# EAGLE design Qwiic EEPROM (EAGLE 9.0.1)
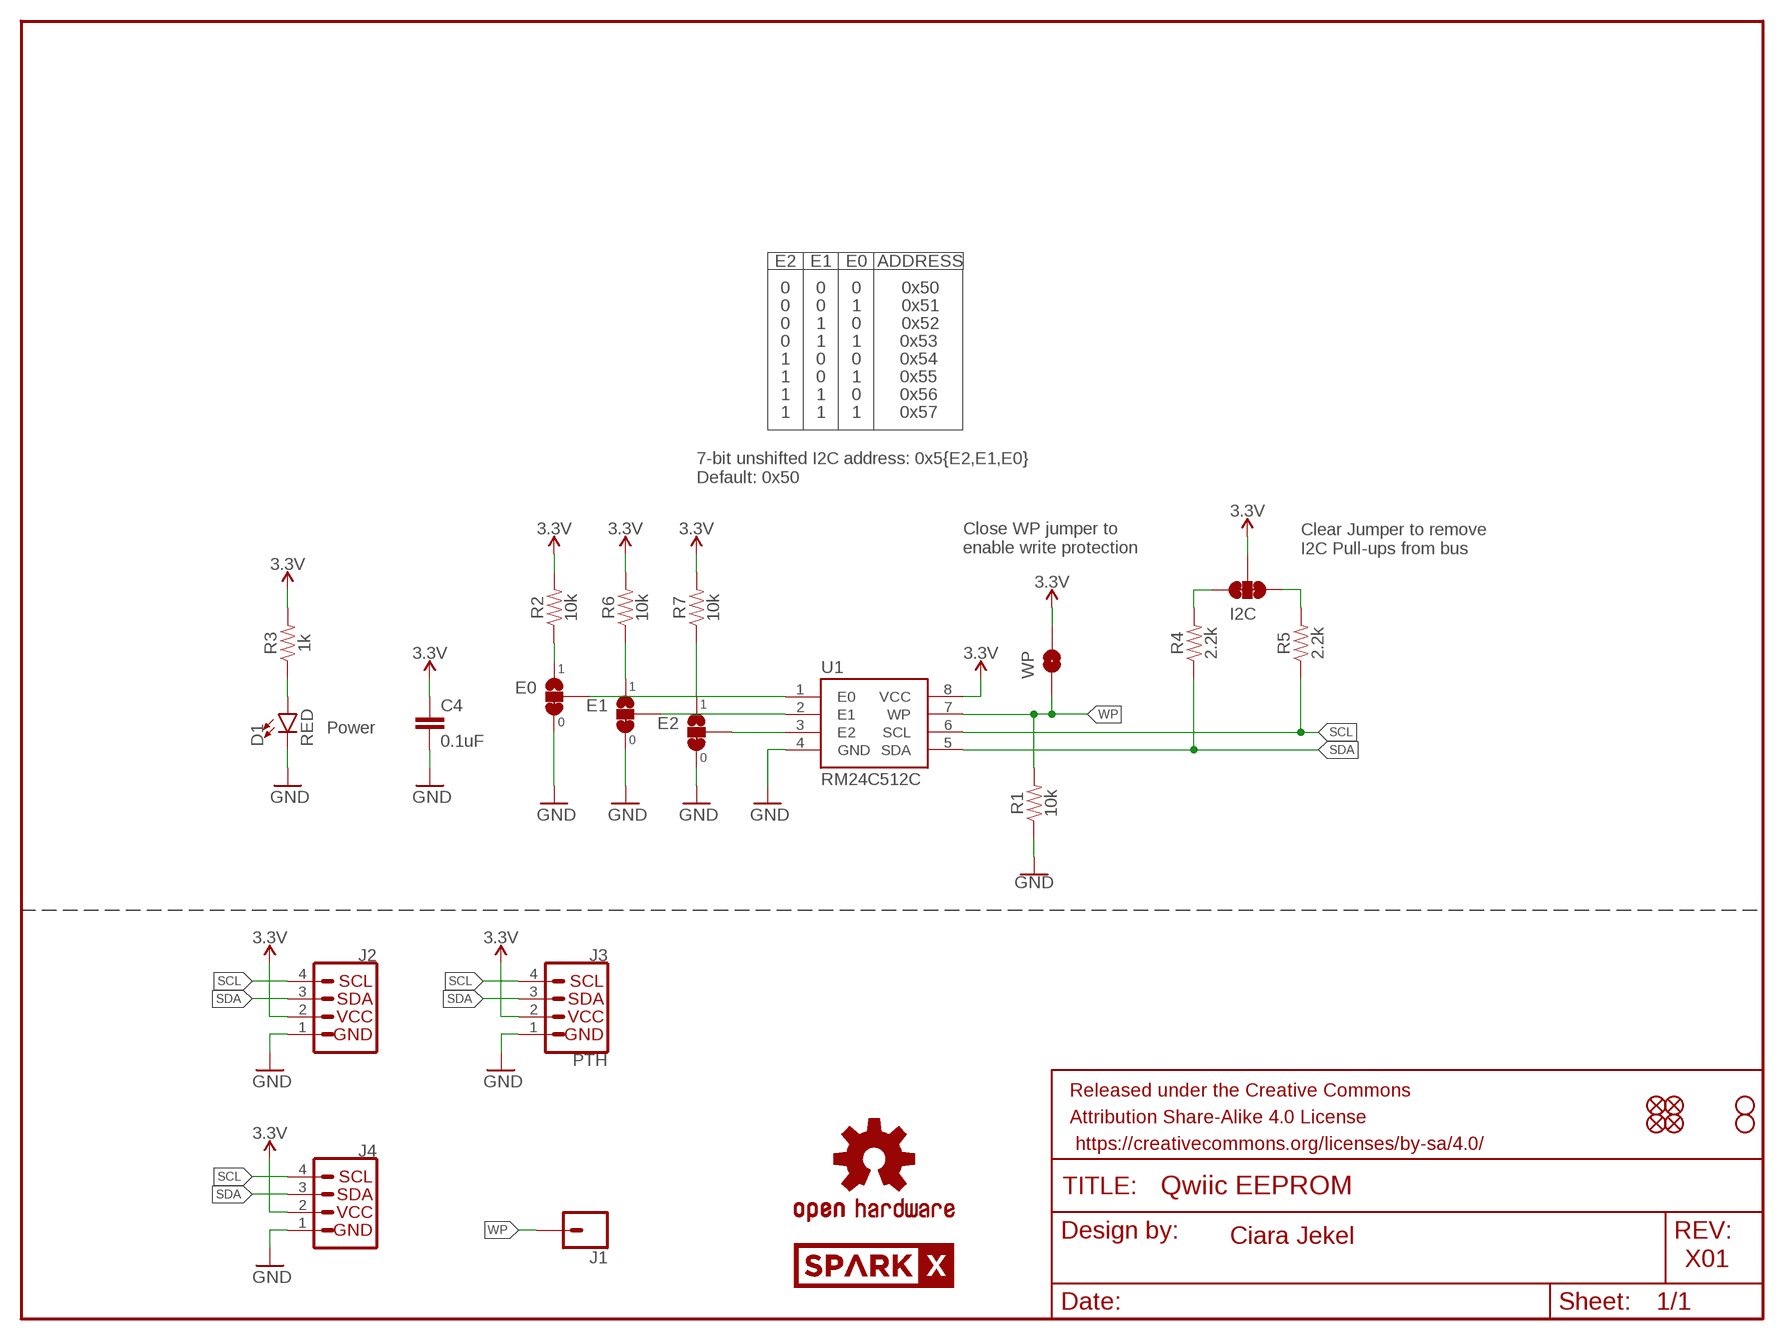
[diagram p0: schematic, sheet 1]

## Parts
C4  0.1uF  0.1UF-0603-25V-(+80/-20%)  [0603]
D1  RED  LED-RED0603  [LED-0603]
E0  JUMPER-SMT_3_1-NC_TRACE_SILK  [SMT-JUMPER_3_1-NC_TRACE_SILK]
E1  JUMPER-SMT_3_1-NC_TRACE_SILK  [SMT-JUMPER_3_1-NC_TRACE_SILK]
E2  JUMPER-SMT_3_1-NC_TRACE_SILK  [SMT-JUMPER_3_1-NC_TRACE_SILK]
FRAME1  FRAME-LETTER  [CREATIVE_COMMONS]
I2C  JUMPER-SMT_3_2-NC_TRACE_SILK  [SMT-JUMPER_3_2-NC_TRACE_SILK]
J1  CONN_01PTH_NO_SILK_YES_STOP  [1X01_NO_SILK]
J2  QWIIC_CONNECTORJS-1MM  [1X04_1MM_RA]
J3  PTH  I2C_STANDARD_NO_SILK  [1X04_NO_SILK]
J4  QWIIC_CONNECTORJS-1MM  [1X04_1MM_RA]
JP1  FIDUCIALUFIDUCIAL  [MICRO-FIDUCIAL]
JP2  FIDUCIALUFIDUCIAL  [MICRO-FIDUCIAL]
JP3  STAND-OFF  [STAND-OFF]
JP4  STAND-OFF  [STAND-OFF]
JP5  FIDUCIALUFIDUCIAL  [MICRO-FIDUCIAL]
JP6  FIDUCIALUFIDUCIAL  [MICRO-FIDUCIAL]
LOGO1  OSHW-LOGOMINI  [OSHW-LOGO-MINI]
R1  10k  10KOHM-0603-1/10W-1%  [0603]
R2  10k  10KOHM-0603-1/10W-1%  [0603]
R3  1k  1KOHM-0603-1/10W-1%  [0603]
R4  2.2k  2.2KOHM-0603-1/10W-1%  [0603]
R5  2.2k  2.2KOHM-0603-1/10W-1%  [0603]
R6  10k  10KOHM-0603-1/10W-1%  [0603]
R7  10k  10KOHM-0603-1/10W-1%  [0603]
U1  RM24C512C  [SO08]
U$1  SPARKX-LOGO4  [SPARKX-MEDIUM]
U$2  SPARKX-LOGO4  [SPARKX-MEDIUM]
WP  JUMPER-SMT_2_NO_SILK  [SMT-JUMPER_2_NO_SILK]

## Nets
3.3V: C4.1 I2C.2 J2.2 J3.2(VCC) J4.2 R2.2 R3.2 R6.2 R7.2 U1.8(VCC) WP.2
GND: C4.2 D1.C E0.3 E1.3 E2.3 J2.1 J3.1(GND) J4.1 R1.1 U1.4(GND)
N$1: I2C.1 R5.2
N$2: I2C.3 R4.2
N$3: D1.A R3.1
N$4: E2.2 U1.3(E2)
N$5: E1.2 U1.2(E1)
N$6: E0.2 U1.1(E0)
N$7: E0.1 R2.1
N$8: E2.1 R7.1
N$9: E1.1 R6.1
SCL: J2.4 J3.4(SCL) J4.4 R5.1 U1.6(SCL)
SDA: J2.3 J3.3(SDA) J4.3 R4.1 U1.5(SDA)
WP: J1.1 R1.2 U1.7(WP) WP.1

## Notes on the sheet
- E2 | E1 | E0 | ADDRESS
- 0 | 0 | 0 | 0x50
- 0 | 0 | 1 | 0x51
- 0 | 1 | 0 | 0x52
- 0 | 1 | 1 | 0x53
- 1 | 0 | 0 | 0x54
- 1 | 0 | 1 | 0x55
- 1 | 1 | 0 | 0x56
- 1 | 1 | 1 | 0x57
- 7-bit unshifted I2C address: 0x5{E2,E1,E0}
  Default: 0x50
- Clear Jumper to remove 
  I2C Pull-ups from bus
- Close WP jumper to 
  enable write protection
- 1
- 1
- 1
- 0
- Power
- 0
- 0
- Ciara Jekel
- X01

## Library data of the parts
C4 = SparkFun-Capacitors:0.1UF: 0.1µF ceramic capacitors A capacitor is a passive two-terminal electrical component used to store electrical energy temporarily in an electric field.; PROD_ID: CAP-00810
D1 = SparkFun-LED:LED-RED: Red SMD LED Used in manufacturing of most products at SparkFun Packages: 0603 - SMD 0603 package [Product Link] <http://docs.avagotech.com/docs/AV02-0551EN> 0603 SMART - SMD 0603 SMART package ( more efficient and expensive)[Product Link] <http://www.osram-os.com/Graphics/XPic2/00077099_0.pdf> 1206 - SMD1206 package [Product Link] <https://www.sparkfun.com/datasheets/DevTools/LilyPad/Q150OVS4.pdff> SparkFun Products: Pro Mini 328 -5V <https://www.sparkfun.com/products/821> RedBoard <https://www.sparkfun.com/products/12757> IOIO-OTG <https://www.sparkfun.com/products/13613>; PROD_ID: DIO-00819
E0 E1 E2 = SparkFun-Jumpers:JUMPER-SMT_3_1-NC_TRACE: Normally closed trace jumper (1 of 2 connections) This jumper has a trace between two pads so it's normally closed (NC). The other connection is normally open (NO). Use a razor knife to open the connection. For best results follow the IPC guidelines for cutting traces: Cutout at least 0.063 mm (0.005 in). Remove all loose material to clean up the cut area. Seal the cut with an approved epoxy. Reapply solder to reclose the connection, or to close the NO connection.
FRAME1 = SparkFun-Aesthetics:FRAME-LETTER: Schematic Frame - Letter Standard 8.5x11 US Letter frame
I2C = SparkFun-Jumpers:JUMPER-SMT_3_2-NC_TRACE: Normally closed trace jumper (2 of 2 connections) This jumper has a trace between all three pads so they are normally closed (NC). Use a razor knife to open the connection(s). For best results follow the IPC guidelines for cutting traces: Cutout at least 0.063 mm (0.005 in). Remove all loose material to clean up the cut area. Seal the cut with an approved epoxy. Reapply solder to reclose the connection(s).
J1 = SparkFun-Connectors:CONN_01: Single connection point. Often used as Generic Header-pin footprint for 0.1 inch spaced/style header connections On any of the 0.1 inch spaced packages, you can populate with these: Break Away Headers - Straight <https://www.sparkfun.com/products/116> (PRT-00116) Break Away Male Headers - Right Angle <https://www.sparkfun.com/products/553> (PRT-00553) Female Headers <https://www.sparkfun.com/products/115> (PRT-00115) Break Away Headers - Machine Pin <https://www.sparkfun.com/products/117> (PRT-00117) Break Away Female Headers - Swiss Machine Pin <https://www.sparkfun.com/products/743> (PRT-00743) This device is also useful as a general connection point to wire up your design to another part of your project. Our various solder wires solder well into these plated through hole pads. Hook-Up Wire - Assortment (Stranded, 22 AWG) <https://www.sparkfun.com/products/11375> (PRT-11375) Hook-Up Wire - Assortment (Solid Core, 22 AWG) <https://www.sparkfun.com/products/11367> (PRT-11367) View the entire wire category on our website here <https://www.sparkfun.com/categories/141> Special notes: SMTSO-256-ET is a "flush mount" nut for a 4-40 screw. We mostly use this on specialty testbeds; it is a nice way to connect hardware to your PCB at an adjustable hieght. Also note, the SNAP packages are for using a snappable style connector. We sell a baggie of snaps and they are also used on two LilyPad designs: Snap Assortment - 30 pack (male and female) <https://www.sparkfun.com/products/11347> (DEV-11347) LilyPad Arduino SimpleSnap <https://www.sparkfun.com/products/10941> (DEV-10941) LilyPad SimpleSnap Protoboard <https://www.sparkfun.com/products/10940> (DEV-10940)
J2 J4 = SparkFun-Connectors:QWIIC_CONNECTOR: SparkFun I2C Standard Qwiic Connector An SMD 1mm pitch JST connector makes it easy and quick (get it? Qwiic?) to connect I2C devices to each other. The Qwiic system <http://www.sparkfun.com/qwiic> enables fast and solderless connection between popular platforms and various sensors and actuators. We carry 200mm <https://www.sparkfun.com/products/14204>, 100mm <https://www.sparkfun.com/products/14205>, 50mm <https://www.sparkfun.com/products/14206>, and breadboard friendly <https://www.sparkfun.com/products/14207> Qwiic cables. We also offer 10 pcs strips <https://www.sparkfun.com/products/14323> the SMD connectors.; PROD_ID: CONN-13694
J3 = SparkX:I2C_STANDARD: SparkFun I2C Standard Pinout Header SparkFun has standardized on a pinout for all I2C based sensor breakouts. This pinout allows I2C boards to be plugged directly into the headers on Arduino Uno compatible boards, and to be daisy chained easily. Example SparkFun Products: SparkFun Atmospheric Sensor Breakout - BME280 <https://www.sparkfun.com/products/13676> SparkFun Altitude/Pressure Sensor Breakout - MPL3115A2 <https://www.sparkfun.com/products/11084> SparkFun TOF Range Finder Sensor - VL6180 <https://www.sparkfun.com/products/12785>
JP1 JP2 JP5 JP6 = SparkFun:FIDUCIAL: Fiducial Alignment Points Various fiducial points for machine vision alignment.
JP3 JP4 = SparkFun:STAND-OFF: Stand Off This is the mechanical footprint for a #4 phillips button head screw. Use the keepout ring to avoid running the screw head into surrounding components. SKU : PRT-00447
LOGO1 = SparkFun-Aesthetics:OSHW-LOGO: Open-Source Hardware (OSHW) Logo This logo indicates the piece of hardware it is found on incorporates a OSHW license and/or adheres to the definition of open source hardware found here: http://freedomdefined.org/OSHW
R1 R2 R6 R7 = SparkFun-Resistors:10KOHM: 10kΩ resistor A resistor is a passive two-terminal electrical component that implements electrical resistance as a circuit element. Resistors act to reduce current flow, and, at the same time, act to lower voltage levels within circuits. - Wikipedia; PROD_ID: RES-00824
R3 = SparkFun-Resistors:1KOHM: 1kΩ resistor A resistor is a passive two-terminal electrical component that implements electrical resistance as a circuit element. Resistors act to reduce current flow, and, at the same time, act to lower voltage levels within circuits. - Wikipedia; PROD_ID: RES-07856
R4 R5 = SparkFun-Resistors:2.2KOHM: 2.2kΩ resistor A resistor is a passive two-terminal electrical component that implements electrical resistance as a circuit element. Resistors act to reduce current flow, and, at the same time, act to lower voltage levels within circuits. - Wikipedia; PROD_ID: RES-08272
U1 = SparkFun-IC-Memory:RM24C512C
U$1 U$2 = SparkX:SPARKX-LOGO
WP = SparkFun-Jumpers:JUMPER-SMT_2_NO: Normally open jumper This jumper has two pads in close proximity to each other. Apply solder to close the connection. Round pads are easier to solder for beginners, but are a lot larger. SparkFun Product that uses the round pads: SparkFun EL Sequencer <https://www.sparkfun.com/products/12781>

## Net classes
1 power: width 0.203 mm

## Board
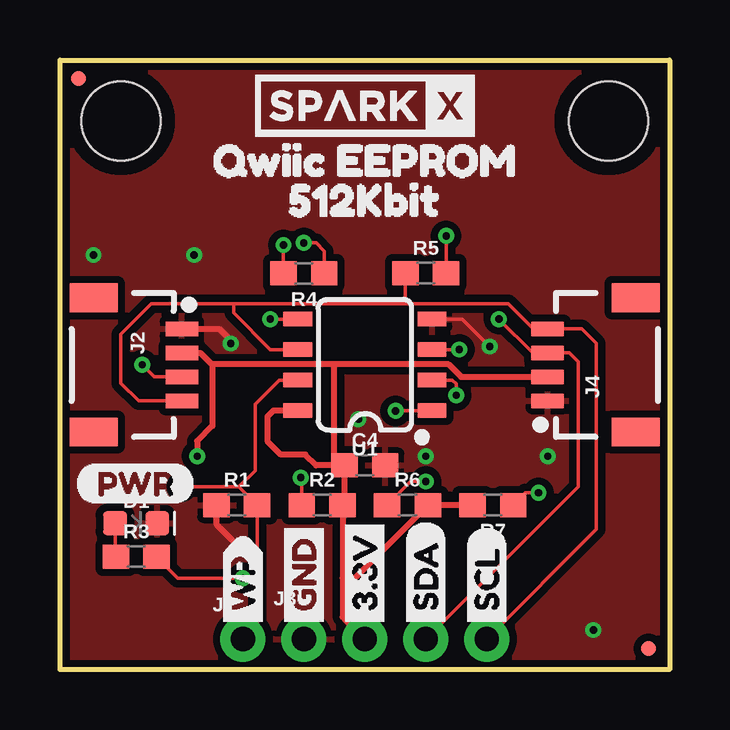
[diagram p1: board, top side]
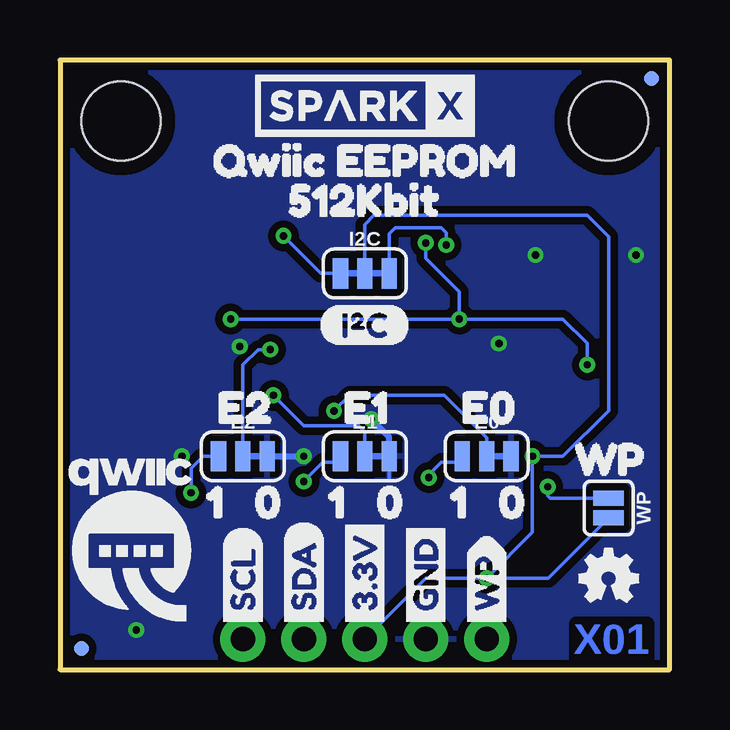
[diagram p2: board, bottom side, seen from below]

Size 25.4 x 25.4 mm. Coordinates in mm from the lower left corner, seen from the top.
Outline: 0,0 0,25.4 25.4,25.4 25.4,0 0,0
Copper layers (1*16): Top 0.035mm / dielectric 1.5mm / Bottom 0.035mm
Design rules "SparkFun-2-layer-PCBWay-LIMIT": minimum track width 6mil, minimum drill 0.3mm, track to track 6mil, track to pad 6mil, pad to pad 6mil, via to via 6mil, smd to smd 6mil, copper to edge 6mil, drill to drill 6mil, minimum pad ring 7mil, minimum via ring 7mil, stop-mask expansion 4mil, vias tented up to drill 25mil, thermal gap 10mil
tRestrict: area 14.4,14 to 14.7,15

### Footprints (pad centres in the part's own frame; a part is rotated, then mirrored left to right if it is on the bottom)
0603 = smd 1.1 x 1: 1 -0.85,0; 2 0.85,0
LED-0603 = smd 1 x 1: A -0.877,0; C 0.877,0
SMT-JUMPER_3_1-NC_TRACE_SILK = smd 0.635 x 1.27: 1 -1.016,0; 2 0,0; 3 1.016,0
SMT-JUMPER_3_2-NC_TRACE_SILK = smd 0.635 x 1.27: 1 -1.016,0; 2 0,0; 3 1.016,0
1X01_NO_SILK = drill 1.016 pad 1.88: 1 0,0
1X04_1MM_RA = smd 0.6 x 1.35: 1 -1.5,0; 2 -0.5,0; 3 0.5,0; 4 1.5,0 | smd 1.2 x 2: NC1 2.8,-3.675; NC2 -2.8,-3.675
1X04_NO_SILK = drill 1.016 pad 1.88: 1 0,0; 2 2.54,0; 3 5.08,0; 4 7.62,0
MICRO-FIDUCIAL = smd 0.635 x 0.635: 1 0,0
STAND-OFF = hole 3.302: 0,0
SO08 = smd 0.6 x 1.2: 1 -1.905,-2.8; 2 -0.635,-2.8; 3 0.635,-2.8; 4 1.905,-2.8; 5 1.905,2.8; 6 0.635,2.8; 7 -0.635,2.8; 8 -1.905,2.8
SMT-JUMPER_2_NO_SILK = smd 0.635 x 1.27: 1 -0.406,0; 2 0.406,0

### Placement (x,y rotation side)
C4  12.7,8.51 0 top
D1  3.17,6.1 0 top
E0  7.62,8.89 0 bottom
E1  12.7,8.89 0 bottom
E2  17.78,8.89 0 bottom
FRAME1  -12.7,-12.7 0 top  (outside the outline)
I2C  12.7,16.51 0 bottom
J1  7.62,1.27 0 top
J2  5.08,12.7 270 top
J3  10.16,1.27 0 top
J4  20.32,12.7 90 top
JP1  0.76,24.64 0 bottom
JP2  24.51,0.89 0 top
JP3  2.54,22.86 0 top
JP4  22.86,22.86 0 top
JP5  24.51,0.89 0 bottom
JP6  0.76,24.64 0 top
LOGO1  2.54,3.81 0 bottom
R1  7.37,6.86 0 top
R2  10.92,6.86 0 top
R3  3.17,4.7 0 top
R4  10.16,16.51 180 top
R5  15.24,16.51 0 top
R6  14.48,6.86 0 top
R7  18.03,6.86 180 top
U1  12.7,12.7 90 top
U$1  12.7,23.5 0 top
U$2  12.7,23.5 0 bottom
U$3  [GND1]  10.16,1.52 90 bottom
U$4  [3#3V2]  12.7,1.52 90 bottom
U$5  [SDA8]  15.24,1.52 90 bottom
U$6  [SCL9]  17.78,1.52 90 bottom
U$7  [WP6]  5.08,8.76 0 bottom
U$8  [E05]  9.78,10.92 0 bottom
U$9  [E23]  19.94,10.92 0 bottom
U$10  [(PWR)]  0.64,7.75 0 top
U$11  [(I_SUPER2_C)]  14.61,14.35 0 bottom
U$12  [00]  18.41,6.99 0 bottom
U$13  [E14]  14.73,10.92 0 bottom
U$14  [512KBIT7]  8.38,19.56 0 top
U$15  [QWIIC_EEPROM2]  5.21,21.21 0 top
U$16  [QWIIC_EEPROM2]  20.19,21.21 0 bottom
U$17  [512KBIT7]  17.02,19.56 0 bottom
U$18  [00]  13.34,6.99 0 bottom
U$19  [00]  8.26,6.99 0 bottom
U$20  [11]  20.45,6.99 0 bottom
U$21  [3#3V2]  12.7,1.52 90 top
U$22  [GND1]  10.16,1.52 90 top
U$23  [11]  15.37,6.99 0 bottom
U$24  [11]  10.29,6.99 0 bottom
U$25  [WP2]  7.62,1.52 90 bottom
U$26  [SCL9]  17.78,1.52 90 top
U$27  [SDA8]  15.24,1.52 90 top
U$28  [WP2]  7.62,1.52 90 top
U$29  [QWIIC-LOGO-MEDIUM]  22.48,5.46 0 bottom
WP  2.54,6.73 270 bottom

### Tracks (layer width: path | path; a pad name or v marks a point on that pad's centre or on a via)
3.3V  (via drill 0.3)
  Top 0.152: J4.2 19.42,12.2 | U1.8 9.53,10.79 | R3.2 4.91,3.81 v7.62,3.81
  Top 0.254: J2.2 5.85,13.2 6.35,12.7 | 6.35,12.7 6.35,10.16 5.71,9.53 v5.71,8.89 | 11.43,12.72 16.2,12.72 16.71,12.2 J4.2 | 11.43,12.72 6.37,12.72 6.35,12.7 | 11.85,2.12 J3.2 11.77,2.2 11.77,3.81 | C4.1 10.67,8.51 10.22,8.95 9.21,8.95 8.64,9.53 8.64,10.54 8.89,10.79 U1.8 | C4.1 11.43,8.93 11.43,12.72 | R7.2 R6.2 12.28,3.81 11.77,3.81 | C4.1 11.85,6.43 | R2.2 11.77,3.81
  Bottom 0.152: I2C.2 12.7,18.54 12.32,18.92 3.43,18.92 2.54,18.03 2.54,10.79 4.45,8.89 v5.71,8.89 5.71,5.71 v7.62,3.81 | v7.62,3.81 10.16,3.81 J3.2 | WP.2 5.05,3.81 v7.62,3.81
GND  (via drill 0.3)
  Top 0.152: J2.1 5.31,13.97 | U1.4 16.76,14.61 v17.91,13.46
  Top 0.254: J2.1 6.63,14.2 7.11,13.72 v7.11,13.59 | R1.1 6.52,6.06 v7.49,5.08
  Bottom 0.152: E1.3 11.68,7.87
  Bottom 0.254: E2.3 v15.24,8.89 | E1.3 11.68,9.68 v12.43,10.43
  other vias: 20.32,8.89 1.4,17.27 5.59,17.27 22.23,1.65
  pour Bottom (isolate 0.305): 0,0 0,25.4 25.4,25.4 25.4,0
  pour Top (isolate 0.305): 0,0 0,25.4 25.4,25.4 25.4,0
N$1  (via drill 0.3)
  Top 0.152: R5.2 v16.09,18.07
  Bottom 0.152: I2C.1 14.53,16.51 v16.09,18.07
N$2  (via drill 0.3)
  Top 0.152: R4.2 v9.31,17.69
  Bottom 0.152: I2C.3 11.68,18.16 11.43,18.41 9.53,18.41 9.31,18.2 v9.31,17.69
N$3
  Top 0.152: D1.A 2.3,4.73 R3.1
N$4  (via drill 0.3)
  Top 0.152: U1.3 v16.64,13.34
  Bottom 0.152: v16.64,13.34 17.14,13.34 17.78,12.7 E2.2
N$5  (via drill 0.3)
  Top 0.152: 15.88,12.06 U1.2 16.35,12.06 16.51,11.9 v16.51,11.43
  Bottom 0.152: v16.51,11.43 15.24,10.16 12.95,10.16 12.7,9.91 E1.2
N$6  (via drill 0.3)
  Top 0.152: 13.84,10.79 13.97,10.79 | 13.97,10.79 U1.1 | 13.97,10.79 v13.98,10.78
  Bottom 0.152: E0.2 7.62,9.65 9.4,11.43 13.34,11.43 v13.98,10.78
N$7  (via drill 0.3)
  Top 0.152: R2.1 10.07,7.96 v10.03,8
  Bottom 0.152: E0.1 8.89,8.64 9.53,8.64 10.03,8.13 v10.03,8
N$8  (via drill 0.3)
  Top 0.152: R7.1 19.39,7.37 v19.94,7.37
  Bottom 0.152: v19.94,7.37 19.94,8.38 19.43,8.89 E2.1
N$9  (via drill 0.3)
  Top 0.152: R6.1 14.61,7.84 v15.24,7.84
  Top 0.254: R6.1 13.63,7.07
  Bottom 0.152: v15.24,7.84 14.45,8.64 13.72,8.64
  Bottom 0.254: 13.72,8.64 E1.1
SCL
  Top 0.152: 14.35,15.24 18.67,15.24 19.71,14.2 J4.4 21.74,14.2 22.35,13.59 22.35,5.84 J3.4 | 14.35,15.24 7.24,15.24 | 7.24,15.24 3.81,15.24 2.54,13.97 2.54,11.94 3.28,11.2 J2.4 | R5.1 14.39,15.28 14.35,15.24 | U1.6 8.76,13.34 7.24,14.86 7.24,15.24
SDA  (via drill 0.3)
  Top 0.152: v18.29,14.61 19.69,13.2 J4.3 21.22,13.2 21.59,12.83 21.59,7.62 J3.3 | J2.3 3.93,12.2 v3.43,12.7 | R4.1 11.01,17.44 10.67,17.78 v10.16,17.78 | U1.5 v8.76,14.61
  Bottom 0.152: v3.43,12.7 3.43,13.59 4.45,14.61 v8.76,14.61 | v10.16,17.78 10.16,17.14 8.76,15.75 v8.76,14.61 | v18.29,14.61 v8.76,14.61
WP  (via drill 0.3)
  Top 0.152: 9.9,12.02 U1.7 9.14,12.06 8.13,11.05 8.13,8.29 7.45,7.62 | J1.1 8.22,1.87 R1.2 7.45,7.62 | 7.45,7.62 v5.08,7.62
  Bottom 0.152: WP.1 4.98,7.14 5.08,7.24 v5.08,7.62

### Text on the board
Bottom: X01
Measures: Dimensions in Inches
tDocu: Ciara Jekel